# Altium schematic sheet 09_POWER.SchDoc: GAP9Shield
size A3; DrawnBy: Hanna Müller and Victor Kartsch; Organization: Integrated Systems Laboratory; DocumentNumber: 9; Revision: v1.0; SheetNumber: 9; SheetTotal: 9
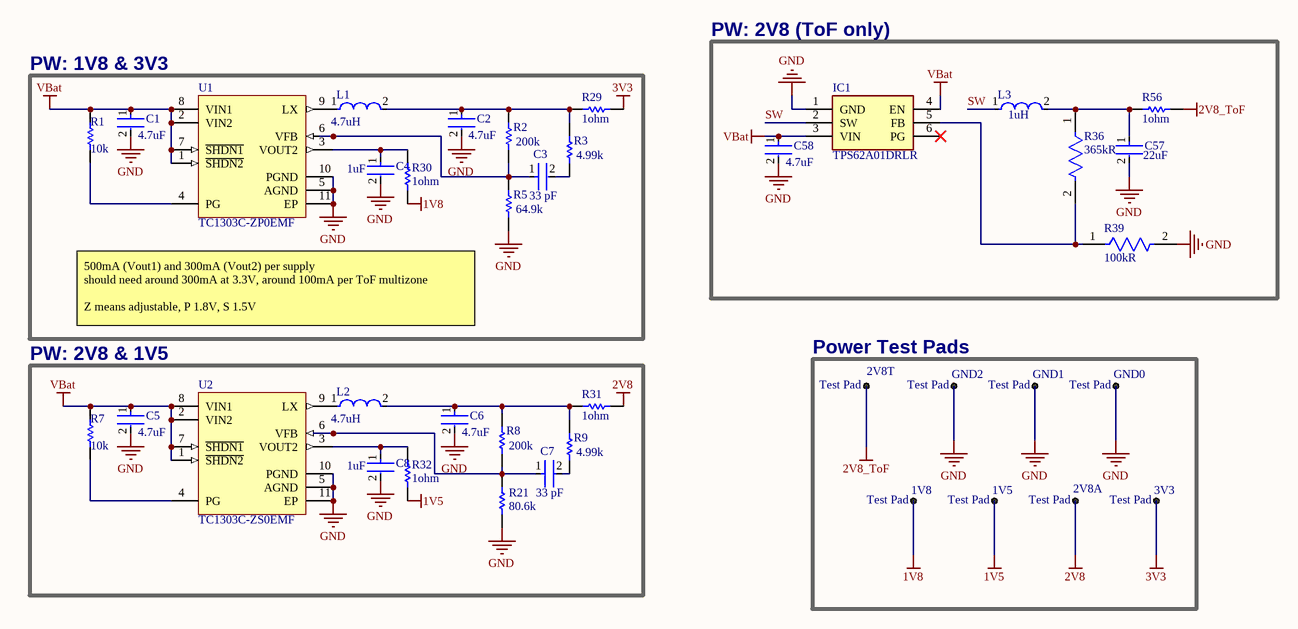
[diagram p0: 09_POWER.SchDoc]

## Parts
1V5  Test Pad  [Pad-1.5mm]  (no BOM)
1V8  Test Pad  [Pad-1.5mm]  (no BOM)
2V8A  Test Pad  [Pad-1.5mm]  (no BOM)
2V8T  Test Pad  [Pad-1.5mm]  (no BOM)
3V3  Test Pad  [Pad-1.5mm]  (no BOM)
C1  value 4.7uF  [FP-C1005-050-0_15-MFG]  (hidden comment: C1005X5R0J475K050BC)
C2  value 4.7uF  [FP-C1005-050-0_15-MFG]  (hidden comment: C1005X5R0J475K050BC)
C3  value 33 pF  [FP-C0402-BB-MFG]  (hidden comment: C0402C330J5GAC)
C4  value 1uF  [FP-GRM155-0_05-IPC_B]  (hidden comment: GRM155R61E105MA12D)
C5  value 4.7uF  [FP-C1005-050-0_15-MFG]  (hidden comment: C1005X5R0J475K050BC)
C6  value 4.7uF  [FP-C1005-050-0_15-MFG]  (hidden comment: C1005X5R0J475K050BC)
C7  value 33 pF  [FP-C0402-BB-MFG]  (hidden comment: C0402C330J5GAC)
C8  value 1uF  [FP-GRM155-0_05-IPC_B]  (hidden comment: GRM155R61E105MA12D)
C57  value 22uF  [FP-GRM158-0_2-IPC_A]  (hidden comment: GRM158R60J226ME01D)
C58  value 4.7uF  [FP-C1005-050-0_15-MFG]  (hidden comment: C1005X5R0J475K050BC)
GND0  Test Pad  [Pad-1.5mm]  (no BOM)
GND1  Test Pad  [Pad-1.5mm]  (no BOM)
GND2  Test Pad  [Pad-1.5mm]  (no BOM)
IC1  TPS62A01DRLR  [SOTFL50P160X60-6N]
L1  Inductance: 4.7uH  [FP-LQM18FN_00-IPC_A]  (hidden comment: LQM18FN4R7M00D)
L2  Inductance: 4.7uH  [FP-LQM18FN_00-IPC_A]  (hidden comment: LQM18FN4R7M00D)
L3  value 1uH  [FP-CBL2012-MFG]  (hidden comment: CBL2012T1R0M)
R1  value 10k  [RESC0603X28X15LL05T05]  (hidden comment: CRCW020110K0FNED)
R2  value 200k  [RESC0603X28X15NL05T05]  (hidden comment: CRCW0201200KFKED)
R3  value 4.99k  [RESC0603X28X15ML05T05]  (hidden comment: CRCW02014K99FKED)
R5  value 64.9k  [RESC0603X28X15LL05T05]  (hidden comment: CRCW020164K9FKED)
R7  value 10k  [RESC0603X28X15LL05T05]  (hidden comment: CRCW020110K0FNED)
R8  value 200k  [RESC0603X28X15NL05T05]  (hidden comment: CRCW0201200KFKED)
R9  value 4.99k  [RESC0603X28X15ML05T05]  (hidden comment: CRCW02014K99FKED)
R21  value 80.6k  [RESC0603X28X15NL05T05]  (hidden comment: CRCW020180K6FNED)
R29  value 1ohm  [RESC1005X40X25ML05T10]  (hidden comment: CRCW04021R00FKEDHP)
R30  value 1ohm  [RESC1005X40X25ML05T10]  (hidden comment: CRCW04021R00FKEDHP)
R31  value 1ohm  [RESC1005X40X25ML05T10]  (hidden comment: CRCW04021R00FKEDHP)
R32  value 1ohm  [RESC1005X40X25ML05T10]  (hidden comment: CRCW04021R00FKEDHP)
R36  value 365kR  [FP-CR0402-IPC_A]  (hidden comment: CR0402-FX-3653GLF)
R39  value 100kR  [FP-ERJ2RK-IPC_C]  (hidden comment: ERJ-2RKF1003X)
R56  value 1ohm  [RESC1005X40X25ML05T10]  (hidden comment: CRCW04021R00FKEDHP)
U1  TC1303C-ZP0EMF  [DFN-MF10]
U2  TC1303C-ZS0EMF  [DFN-MF10]

## Blocks framed on the sheet
PW: 1V8 & 3V3: C1-C4 L1 R1-R3 R5 R29 R30 U1
PW: 2V8 (ToF only): C57 C58 IC1 L3 R36 R39 R56
Power Test Pads: 1V5 1V8 2V8A 2V8T 3V3 GND0-GND2
PW: 2V8 & 1V5: C5-C8 L2 R7-R9 R21 R31 R32 U2

## Nets
1V5: 1V5.1 R32.2
1V8: 1V8.1 R30.2
2V8: 2V8A.1 R31.1
2V8_ToF: 2V8T.1 R56.1
3V3: 3V3.1 R29.1
GND: C1.2 C2.2 C4.2 C5.2 C6.2 C8.2 C57.2 C58.2 GND0.1 GND1.1 GND2.1 IC1.1(GND) R5.1 R21.1 R39.2 U1.5(AGND) U1.10(PGND) U1.11(EP) U2.5(AGND) U2.10(PGND) U2.11(EP)
VBat: C1.1 C5.1 C58.1 IC1.3(VIN) IC1.4(EN) R1.2 R7.2 U1.1(~{SHDN2}) U1.2(VIN2) U1.7(~{SHDN1}) U1.8(VIN1) U2.1(~{SHDN2}) U2.2(VIN2) U2.7(~{SHDN1}) U2.8(VIN1)
SW: IC1.2(SW) L3.1
NetC2_1: C2.1 L1.2 R2.2 R3.2 R29.2
NetC3_1: C3.1 R2.1 R5.2 U1.6(VFB)
NetC3_2: C3.2 R3.1
NetC4_1: C4.1 R30.1 U1.3(VOUT2)
NetC6_1: C6.1 L2.2 R8.2 R9.2 R31.2
NetC7_1: C7.1 R8.1 R21.2 U2.6(VFB)
NetC7_2: C7.2 R9.1
NetC8_1: C8.1 R32.1 U2.3(VOUT2)
NetC57_1: C57.1 L3.2 R36.1 R56.2
NetIC1_5: IC1.5(FB) R36.2 R39.1
NetL1_1: L1.1 U1.9(LX)
NetL2_1: L2.1 U2.9(LX)
NetR1_1: R1.1 U1.4(PG)
NetR7_1: R7.1 U2.4(PG)

Not connected (* = marked no-connect by the designer): IC1 6(PG)*

## Notes on the sheet
- 500mA (Vout1) and 300mA (Vout2) per supply
  should need around 300mA at 3.3V, around 100mA per ToF multizone
  Z means adjustable, P 1.8V, S 1.5V
- 1
- 2
- 3
- 4
- 5
- 6
- 7
- 8
- A
- B
- C
- D
- Project:
- Date:
- Drawing number:
- Rev:
- Format:
- A3
- Drawn by:
- Laboratory:
- Page
- Sheet:
- of
- File:

## Library data of the parts
1V5 1V8 2V8A 2V8T 3V3 GND0-GND2 = CMP-01283-1: 1mm SMT Test Pad; Mounting Technology: SMT
C1 C2 C5 C6 C58 = CMP-2000-05437-2: CAP CER 4.7UF 6.3V X5R 0402; Tolerance: 10%; Dielectric Material: Ceramic; Voltage: 6.3V; Capacitance: 4.7uF; Depth: 0.5mm; Height: 0.5mm; Length: 1mm; Termination: SMD/SMT; RoHS Compliant: Yes; Series: C; Case/Package: 0402; Dielectric: X5R; Lead Free: Lead Free; Mount: Surface Mount; Max Operating Temperature: 85°C; Min Operating Temperature: -55°C
C3 C7 = CMP-03020-007781-1: C0402 33 pF C0G 5.00% 50 V; Manufacturer: Kemet; Voltage Rating: 50 V; Material: Ceramic; Temperature Coefficient: 15%; Tolerance: 0.05; Package: C0402-BB; Temperature Range High: +125°C; Device Class L3: Ceramic Capacitors; RoHS: TRUE; ComponentLink2Description: Datasheet; Device Class L1: Passive Components; Octopart: https://octopart.com/c0402c330j5gac-kemet-2551464; Automotive: No; Temperature: -55°C to +125°C; Mouser Description: Capacitor, 33PF 50V Npo 0402CAPACITOR, 33PF 50V Npo 0402; Capacitance: 33PF; Voltage Rating, DC: 50V; Capacitor...; Temperature Range Low: -55°C; Lead Free: Yes; Manufacturer Part Number: C0402C330J5GAC; Device Class L2: Capacitors; Ipc Land Pattern Name: CAPC10050X50; ComponentLink2URL: https://content.kemet.com/datasheets/KEM_C1002_X7R_SMD.pdf; Height: 0.55mm; Temperature Characteristic: C0G; Capacitance: 33 pF; Category: Cap
C4 C8 = CMP-06035-012395-1: Chip Multilayer Ceramic Capacitors for General Purpose, 0402, 1.0uF, X5R, 15%, 20%, 25V; Weight: 0.000212oz; Dielectric: X5R; Case Code (Metric): 1005; Thickness: 0.022inch; Min Operating Temperature: -55°C; Voltage Rating (DC): 25V; Lead Free: Lead Free; Voltage Rating: 25V; Max Operating Temperature: 85°C; Case/Package: 0402; Packaging: Tape and Reel; Package Quantity: 10000; Termination: SMD/SMT; Height: 0.5mm; Width: 0.5mm; Mount: Surface Mount; Case Code (Imperial): 0402; Tolerance: 20%; Capacitance: 1uF; Length: 0.039inch
C57 = CMP-06035-062950-1: CAP CER 22UF 6.3V X5R 0402
IC1 = TPS62A01DRLR: Integrated Circuit; Manufacturer_Name: Texas Instruments; Datasheet Link: https://www.arrow.com/en/products/tps62a01drlr/texas-instruments?region=nac; Height: 0.6mm; Manufacturer_Part_Number: TPS62A01DRLR; Mouser Part Number: 595-TPS62A01DRLR; Mouser Price/Stock: https://www.mouser.co.uk/ProductDetail/Texas-Instruments/TPS62A01DRLR?qs=Znm5pLBrcALcIfh%2FYrJRtw%3D%3D; Arrow Part Number: TPS62A01DRLR; Arrow Price/Stock: https://www.arrow.com/en/products/tps62a01drlr/texas-instruments?region=nac
L1 L2 = CMP-06042-016387-1: FIXED IND 4.7UH 80MA 600 MOHM; Self Resonant Frequency: 50MHz; Core Material: Ferrite; DC Resistance (DCR): 600mR; Test Frequency: 1MHz; Shielding: Shielded; Tolerance: 20%; Max DC Current: 80mA; Width: 0.031inch; RoHS Compliant: Yes; Packaging: Tape and Reel; Case Code (Metric): 1608; Weight: 7.1E-05oz; Lead Free: Lead Free; DC Current: 80mA; Height - Seated (Max): 0.035inch; Rated Current-Max: 80mA; Max Operating Temperature: 125°C; Height: 0.8mm; Radiation Hardening: No; Current Rating: 80mA; Package Quantity: 4000; Case Code (Imperial): 0603; Case/Package: 0603; Termination: SMD/SMT; Min Operating Temperature: -55°C; Mount: Surface Mount; Series: LQM18F; Saturation Current: 80mA; Depth: 0.9mm; Military Standard: Not; Length: 1.6mm; value: 4.7 uH
L3 = CMP-14484-000072-1: FIXED IND 1UH 950MA 195 MOHM SMD; Inductor Type: POWER; Shielding: Unshielded; Inductance Tolerance: 20%; Self Resonant Frequency: 100MHz; Test Frequency: 100kHz; DC Resistance (DCR): 195mR; Saturation Current: 620mA; Core Material: Ferrite; Case Code (Metric): 2012; RoHS Compliant: Yes; Length: 0.079inch; Termination: SMD/SMT; Series: CB; Resistor Type: Wirewound; Number of Pins: 2; Lead Free: Exempt; Depth: 1.45mm; Package Quantity: 4000; Packaging: Tape and Reel; Height - Seated (Max): 0.039inch; Max Operating Temperature: 105°C; Case/Package: 0805; Case Code (Imperial): 0805; Width: 0.049inch; Halogen Free: Halogen Free; Mount: Surface Mount; Tolerance: 20%; Radiation Hardening: No; Current Rating: 950mA; Min Operating Temperature: -40°C; Inductance: 1uH; Max DC Current: 950mA; Height: 0.9mm
R1 R7 = CMP-2004-00016-1: Manufacturer: Vishay Dale; Part Number: CRCW020110K0FNED
R2 R8 = CMP-2004-00281-1: Manufacturer: Vishay Dale; Part Number: CRCW0201200KFKED
R3 R9 = CMP-2004-00678-1: Manufacturer: Vishay Dale; Part Number: CRCW02014K99FKED
R5 = CMP-1010-00621-2: Manufacturer: Vishay Dale; Part Number: CRCW020164K9FKED
R21 = CMP-2004-00882-1: Manufacturer: Vishay Dale; Part Number: CRCW020180K6FNED
R29-R32 R56 = CMP-2002-03047-1: Manufacturer: Vishay Dale; Part Number: CRCW04021R00FKEDHP
R36 = CMP-2002-05125-2: Thick Film Chip Resistors 0402 365kΩ 0.0625W 1% 100ppm/°C; Max Power Dissipation: 63mW; Package Quantity: 10000; Min Operating Temperature: -55°C; Resistance: 365kR; Thickness: 356um; Mount: Surface Mount; Number of Terminations: 2; Tolerance: 1%; Packaging: Tape and Reel; Max Operating Temperature: 155°C; Temperature Coefficient: 100ppm/°C; Resistor Type: Thick Film; Case/Package: 0402; Series: CR0402; Height: 0.016inch; RoHS Compliant: Yes; Width: 0.02inch; Length: 0.039inch
R39 = CMP-2002-00608-4: RES SMD 100K OHM 1% 1/10W 0402; Voltage Rating (DC): 50V; Power Rating: 100mW; Temperature Coefficient: 100ppm/°C; Case/Package: 0402; Length: 1mm; Package Quantity: 1; Radiation Hardening: No; Case Code (Metric): 1005; Contact Plating: Tin; Mount: Surface Mount; Depth: 0.5mm; Resistance: 100kR; Max Operating Temperature: 155°C; Lead Free: Lead Free; Width: 0.5mm; Composition: Thick Film; Case Code (Imperial): 0402; Tolerance: 1%; Termination: SMD/SMT; Number of Pins: 2; Height: 0.35mm; Voltage Rating: 50V; Military Standard: Not; REACH SVHC: No SVHC; Packaging: Tape and Reel; Min Operating Temperature: -55°C; Max Power Dissipation: 100mW; Features: Automotive AEC-Q200; Number of Terminations: 2
U1 = CMP-0139-00073-1: 500mA Synchronous Buck Regulator + 300mA LDO with Power-Good Output, Adjustable, 1.8V, 10-Pin DFN, Industrial Temperature; PackageVersion: revBB, Aug-2009; PackageDescription: 10-Lead Plastic Dual Flat, No Lead Package (MF) - 3x3x0.9mm Body [DFN]; PackageReference: DFN-MF10; DatasheetVersion: revB, Jul-2005
U2 = CMP-0139-00077-1: 500mA Synchronous Buck Regulator + 300mA LDO with Power-Good Output, Adjustable, 1.5V, 10-Pin DFN, Industrial Temperature; PackageDescription: 10-Lead Plastic Dual Flat, No Lead Package (MF) - 3x3x0.9mm Body [DFN]; PackageVersion: revBB, Aug-2009; DatasheetVersion: revB, Jul-2005; PackageReference: DFN-MF10